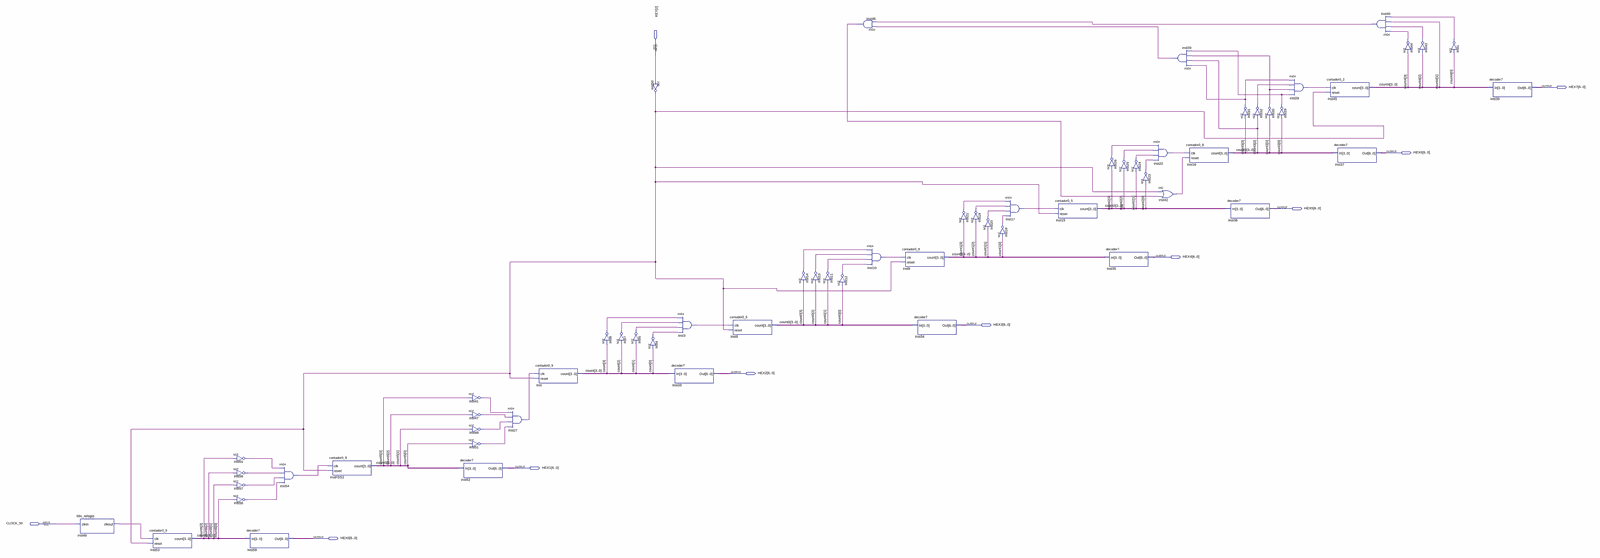
[diagram p0: schematic sheet, whole]
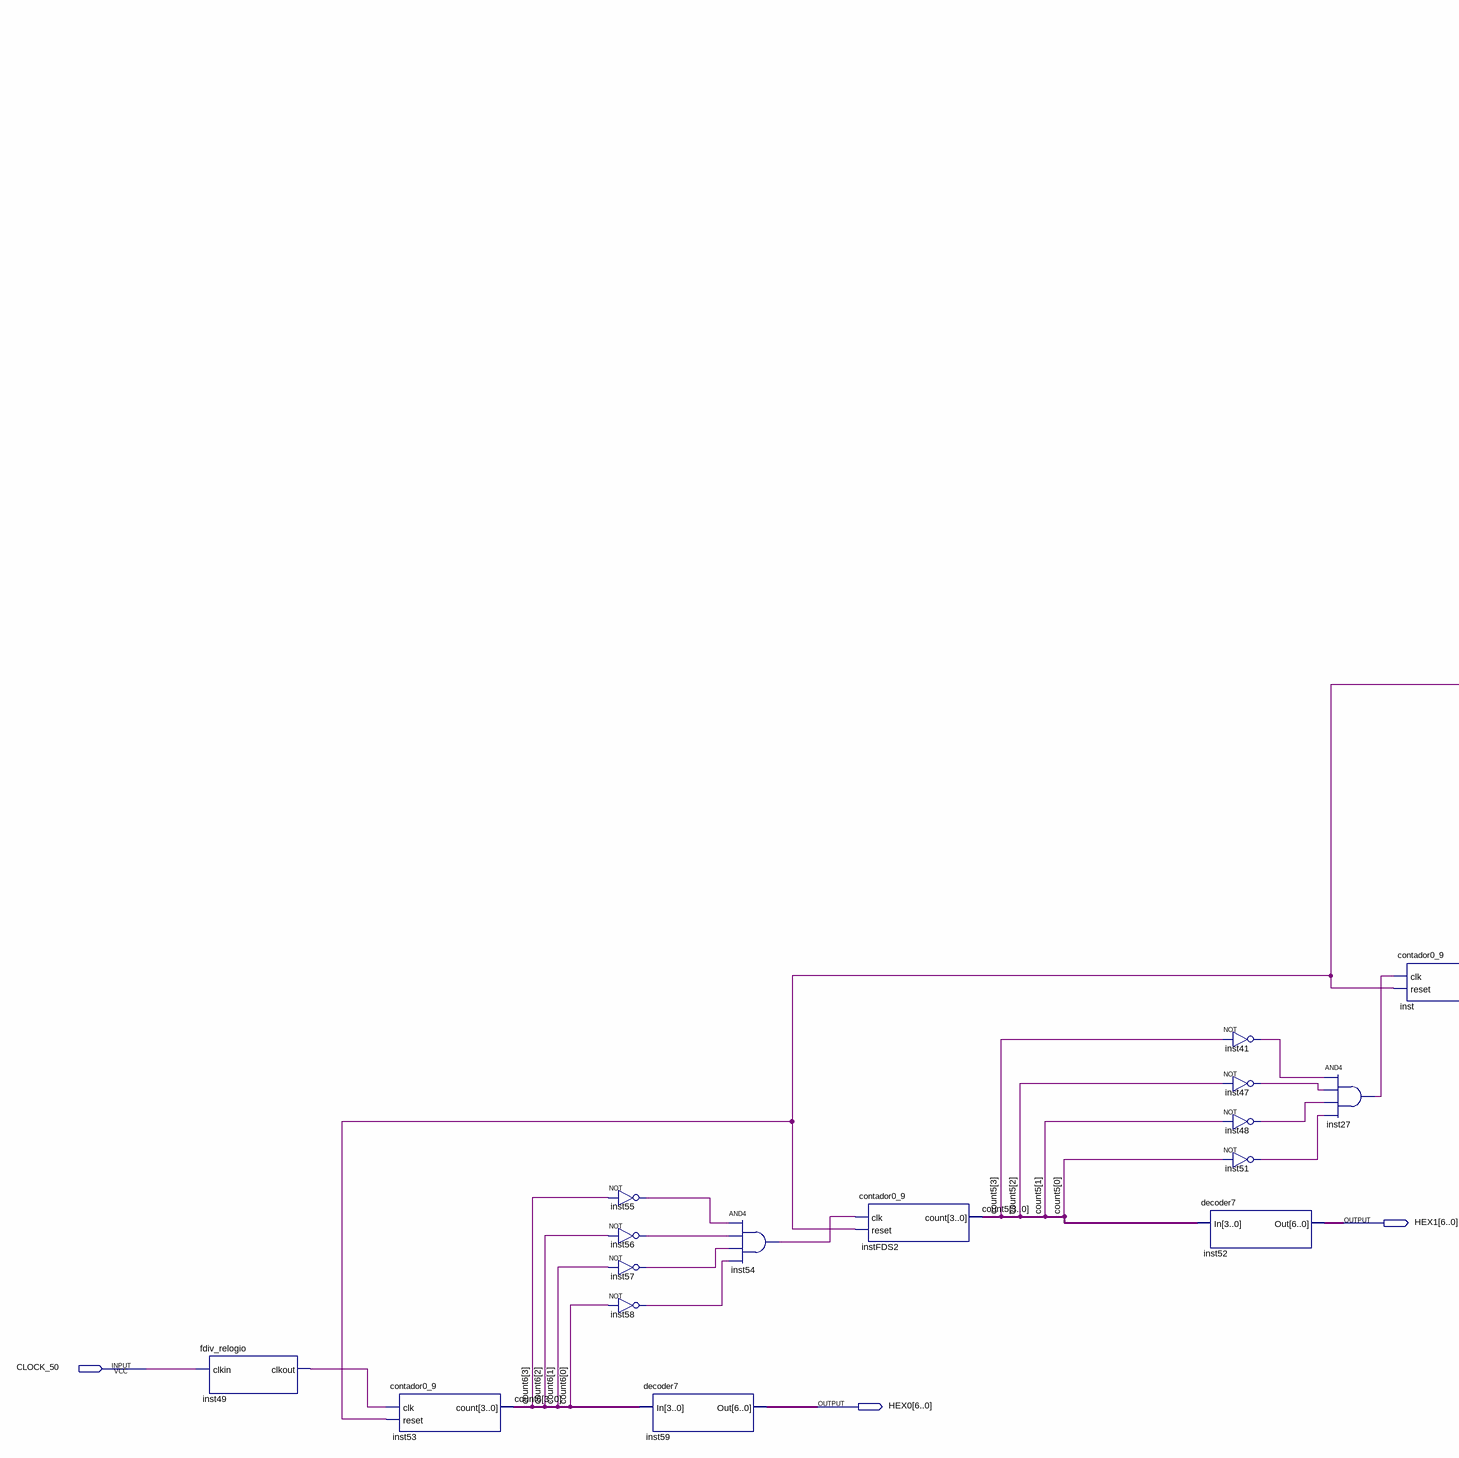
[diagram p1: schematic sheet, left part]
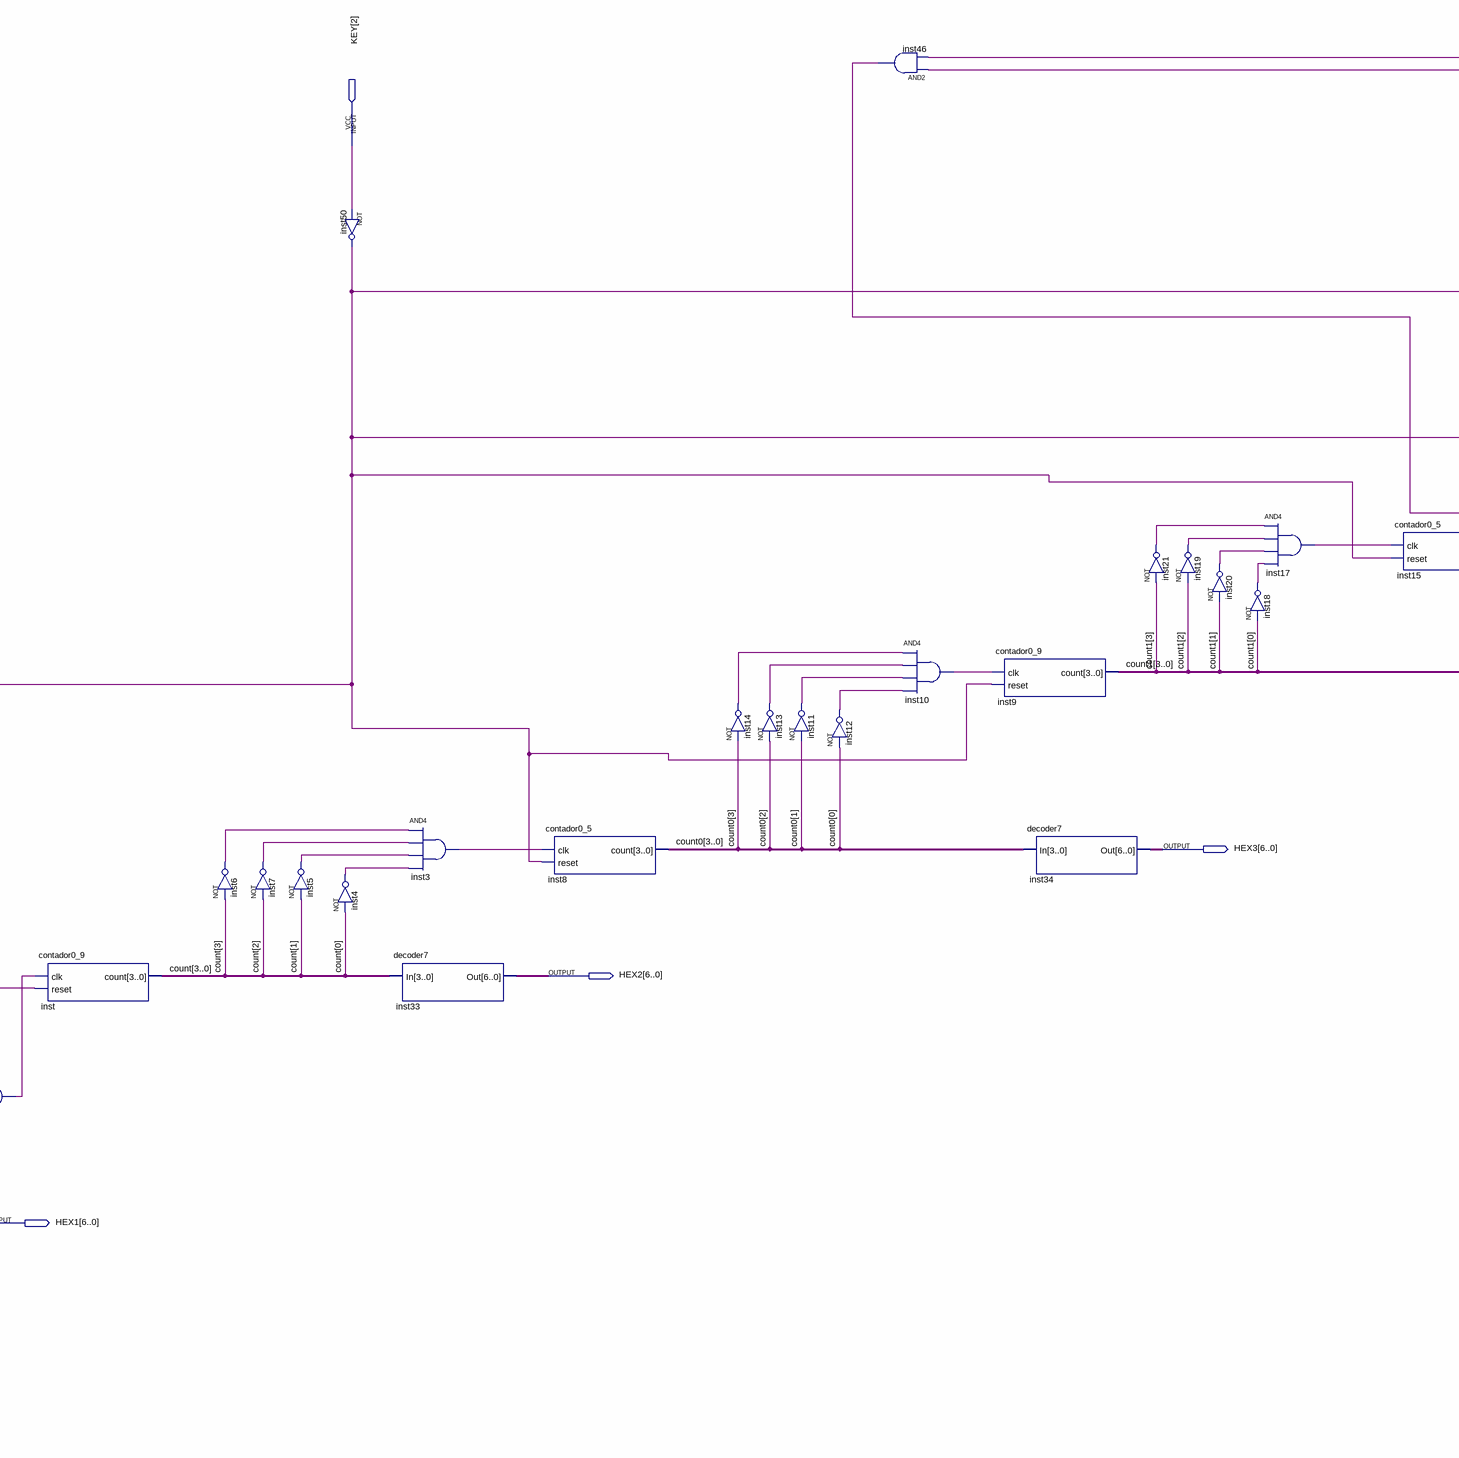
[diagram p2: schematic sheet, centre part]
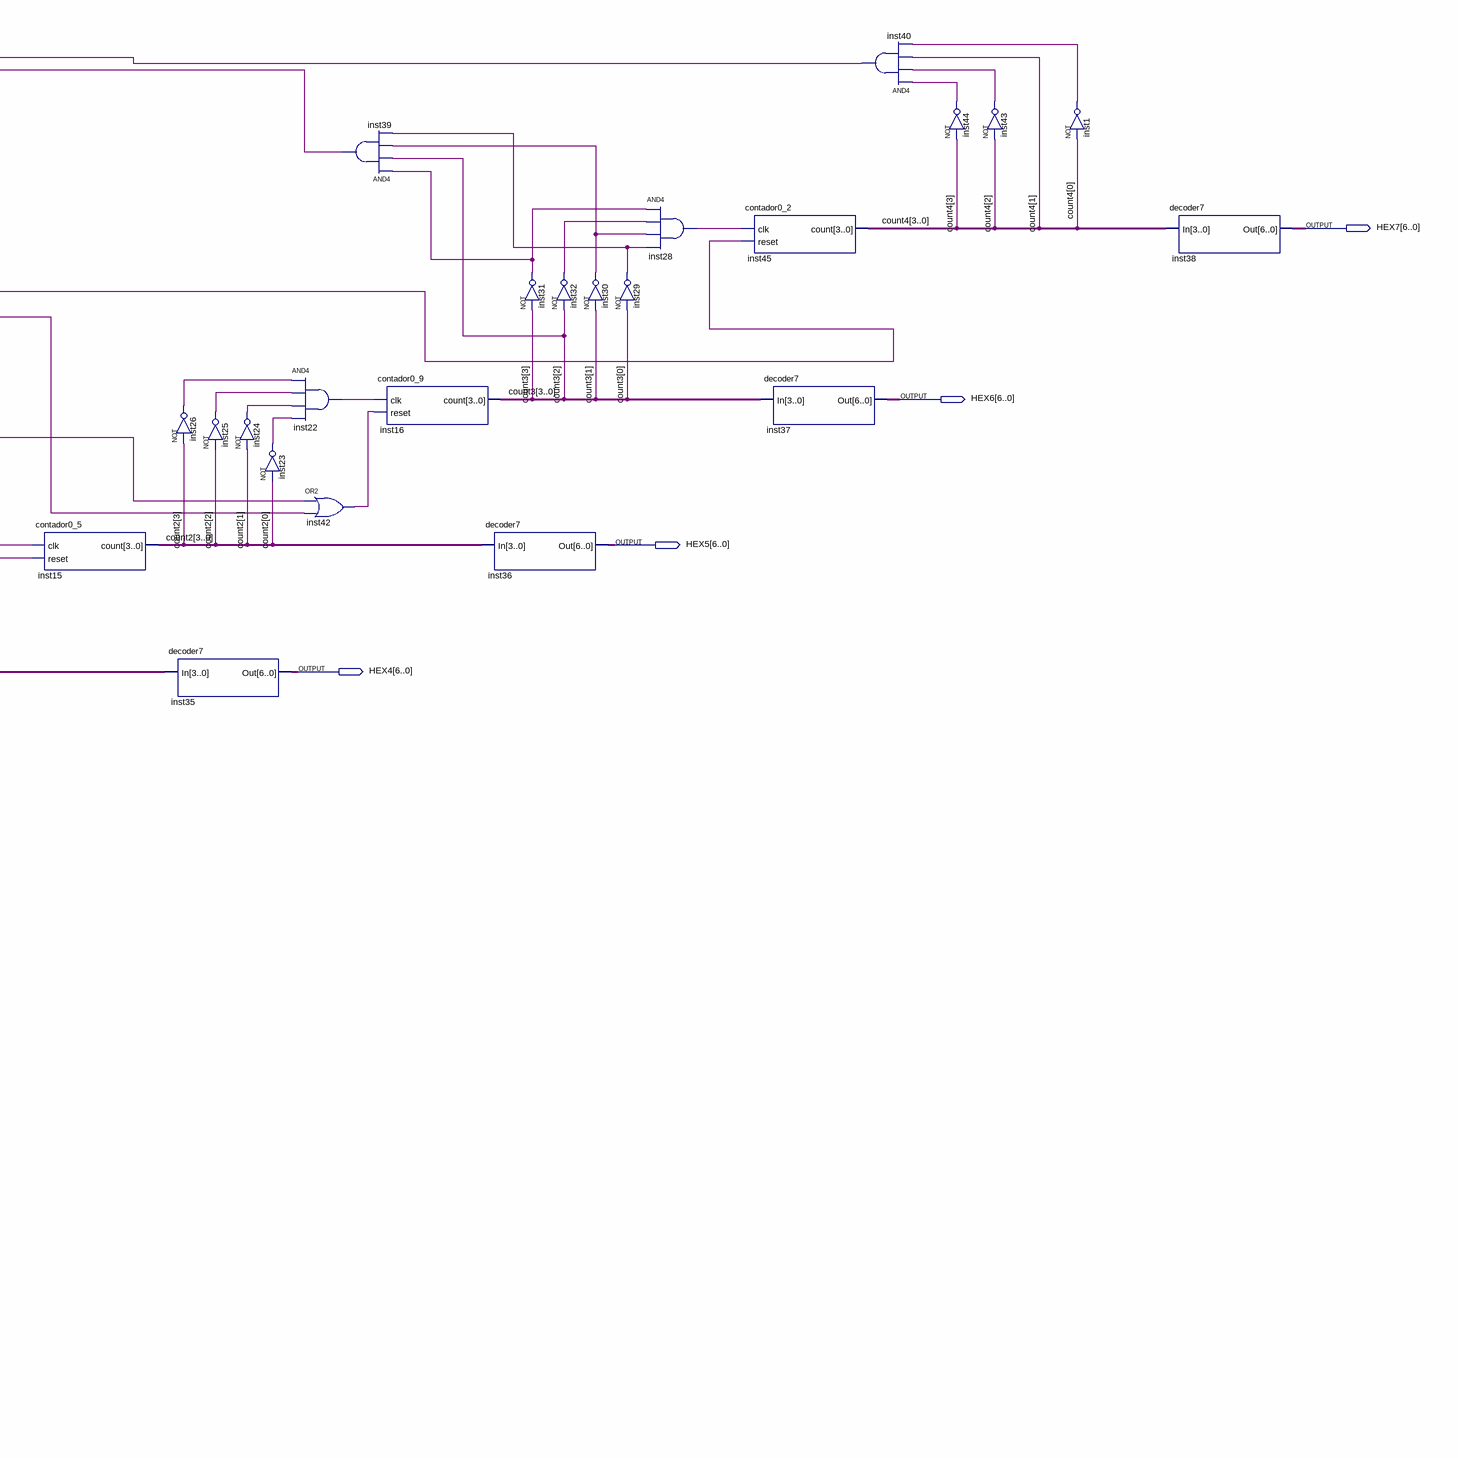
[diagram p3: schematic sheet, right part]
// Quartus schematic relogio.bdf as structural Verilog: 60 symbols, 10 pins
module relogio (
  input  [2:2] KEY,
  input  CLOCK_50,
  output [6:0] HEX7,
  output [6:0] HEX6,
  output [6:0] HEX5,
  output [6:0] HEX4,
  output [6:0] HEX3,
  output [6:0] HEX2,
  output [6:0] HEX1,
  output [6:0] HEX0
);

  wire inst1_out, inst3_out, inst4_out, inst5_out, inst6_out, inst7_out, inst10_out, inst11_out, inst12_out,
       inst13_out, inst14_out, inst17_out, inst18_out, inst19_out, inst20_out, inst21_out, inst22_out,
       inst23_out, inst24_out, inst25_out, inst26_out, inst27_out, inst28_out, inst29_out, inst30_out,
       inst31_out, inst32_out, inst39_out, inst40_out, inst41_out, inst42_out, inst43_out, inst44_out,
       inst46_out, inst47_out, inst48_out, inst49_clkout, inst50_out, inst51_out, inst54_out, inst55_out,
       inst56_out, inst57_out, inst58_out;
  wire [3:0] count, count0, count1, count2, count3, count4, count5, count6;

  fdiv_relogio inst49 (.clkin(CLOCK_50), .clkout(inst49_clkout));
  contador0_9 inst53 (.clk(inst49_clkout), .reset(inst50_out), .count(count6));
  not inst55 (inst55_out, count6[3]);
  not inst56 (inst56_out, count6[2]);
  not inst57 (inst57_out, count6[1]);
  not inst58 (inst58_out, count6[0]);
  decoder7 inst59 (.In(count6), .Out(HEX0));
  and inst54 (inst54_out, inst55_out, inst56_out, inst57_out, inst58_out);
  contador0_9 instFDS2 (.clk(inst54_out), .reset(inst50_out), .count(count5));
  not inst41 (inst41_out, count5[3]);
  not inst47 (inst47_out, count5[2]);
  not inst48 (inst48_out, count5[1]);
  not inst51 (inst51_out, count5[0]);
  decoder7 inst52 (.In(count5), .Out(HEX1));
  and inst27 (inst27_out, inst41_out, inst47_out, inst48_out, inst51_out);
  contador0_9 inst (.clk(inst27_out), .reset(inst50_out), .count(count));
  not inst6 (inst6_out, count[3]);
  not inst7 (inst7_out, count[2]);
  not inst5 (inst5_out, count[1]);
  not inst4 (inst4_out, count[0]);
  not inst50 (inst50_out, KEY[2]);
  and inst3 (inst3_out, inst6_out, inst7_out, inst5_out, inst4_out);
  decoder7 inst33 (.In(count), .Out(HEX2));
  contador0_5 inst8 (.clk(inst3_out), .reset(inst50_out), .count(count0));
  not inst14 (inst14_out, count0[3]);
  not inst13 (inst13_out, count0[2]);
  not inst11 (inst11_out, count0[1]);
  not inst12 (inst12_out, count0[0]);
  and inst46 (inst46_out, inst39_out, inst40_out);
  and inst10 (inst10_out, inst14_out, inst13_out, inst11_out, inst12_out);
  contador0_9 inst9 (.clk(inst10_out), .reset(inst50_out), .count(count1));
  decoder7 inst34 (.In(count0), .Out(HEX3));
  not inst21 (inst21_out, count1[3]);
  not inst19 (inst19_out, count1[2]);
  not inst20 (inst20_out, count1[1]);
  not inst18 (inst18_out, count1[0]);
  and inst17 (inst17_out, inst21_out, inst19_out, inst20_out, inst18_out);
  contador0_5 inst15 (.clk(inst17_out), .reset(inst50_out), .count(count2));
  not inst26 (inst26_out, count2[3]);
  decoder7 inst35 (.In(count1), .Out(HEX4));
  not inst25 (inst25_out, count2[2]);
  not inst24 (inst24_out, count2[1]);
  and inst22 (inst22_out, inst26_out, inst25_out, inst24_out, inst23_out);
  not inst23 (inst23_out, count2[0]);
  and inst39 (inst39_out, inst31_out, count3[2], inst30_out, inst29_out);
  or inst42 (inst42_out, inst50_out, inst46_out);
  contador0_9 inst16 (.clk(inst22_out), .reset(inst42_out), .count(count3));
  decoder7 inst36 (.In(count2), .Out(HEX5));
  not inst31 (inst31_out, count3[3]);
  not inst32 (inst32_out, count3[2]);
  not inst30 (inst30_out, count3[1]);
  and inst28 (inst28_out, inst31_out, inst32_out, inst30_out, inst29_out);
  not inst29 (inst29_out, count3[0]);
  contador0_2 inst45 (.clk(inst28_out), .reset(inst50_out), .count(count4));
  decoder7 inst37 (.In(count3), .Out(HEX6));
  and inst40 (inst40_out, inst44_out, inst43_out, count4[1], inst1_out);
  not inst44 (inst44_out, count4[3]);
  not inst43 (inst43_out, count4[2]);
  not inst1 (inst1_out, count4[0]);
  decoder7 inst38 (.In(count4), .Out(HEX7));
endmodule
